# Altium schematic sheet Sheet1.SCHDOC
size B
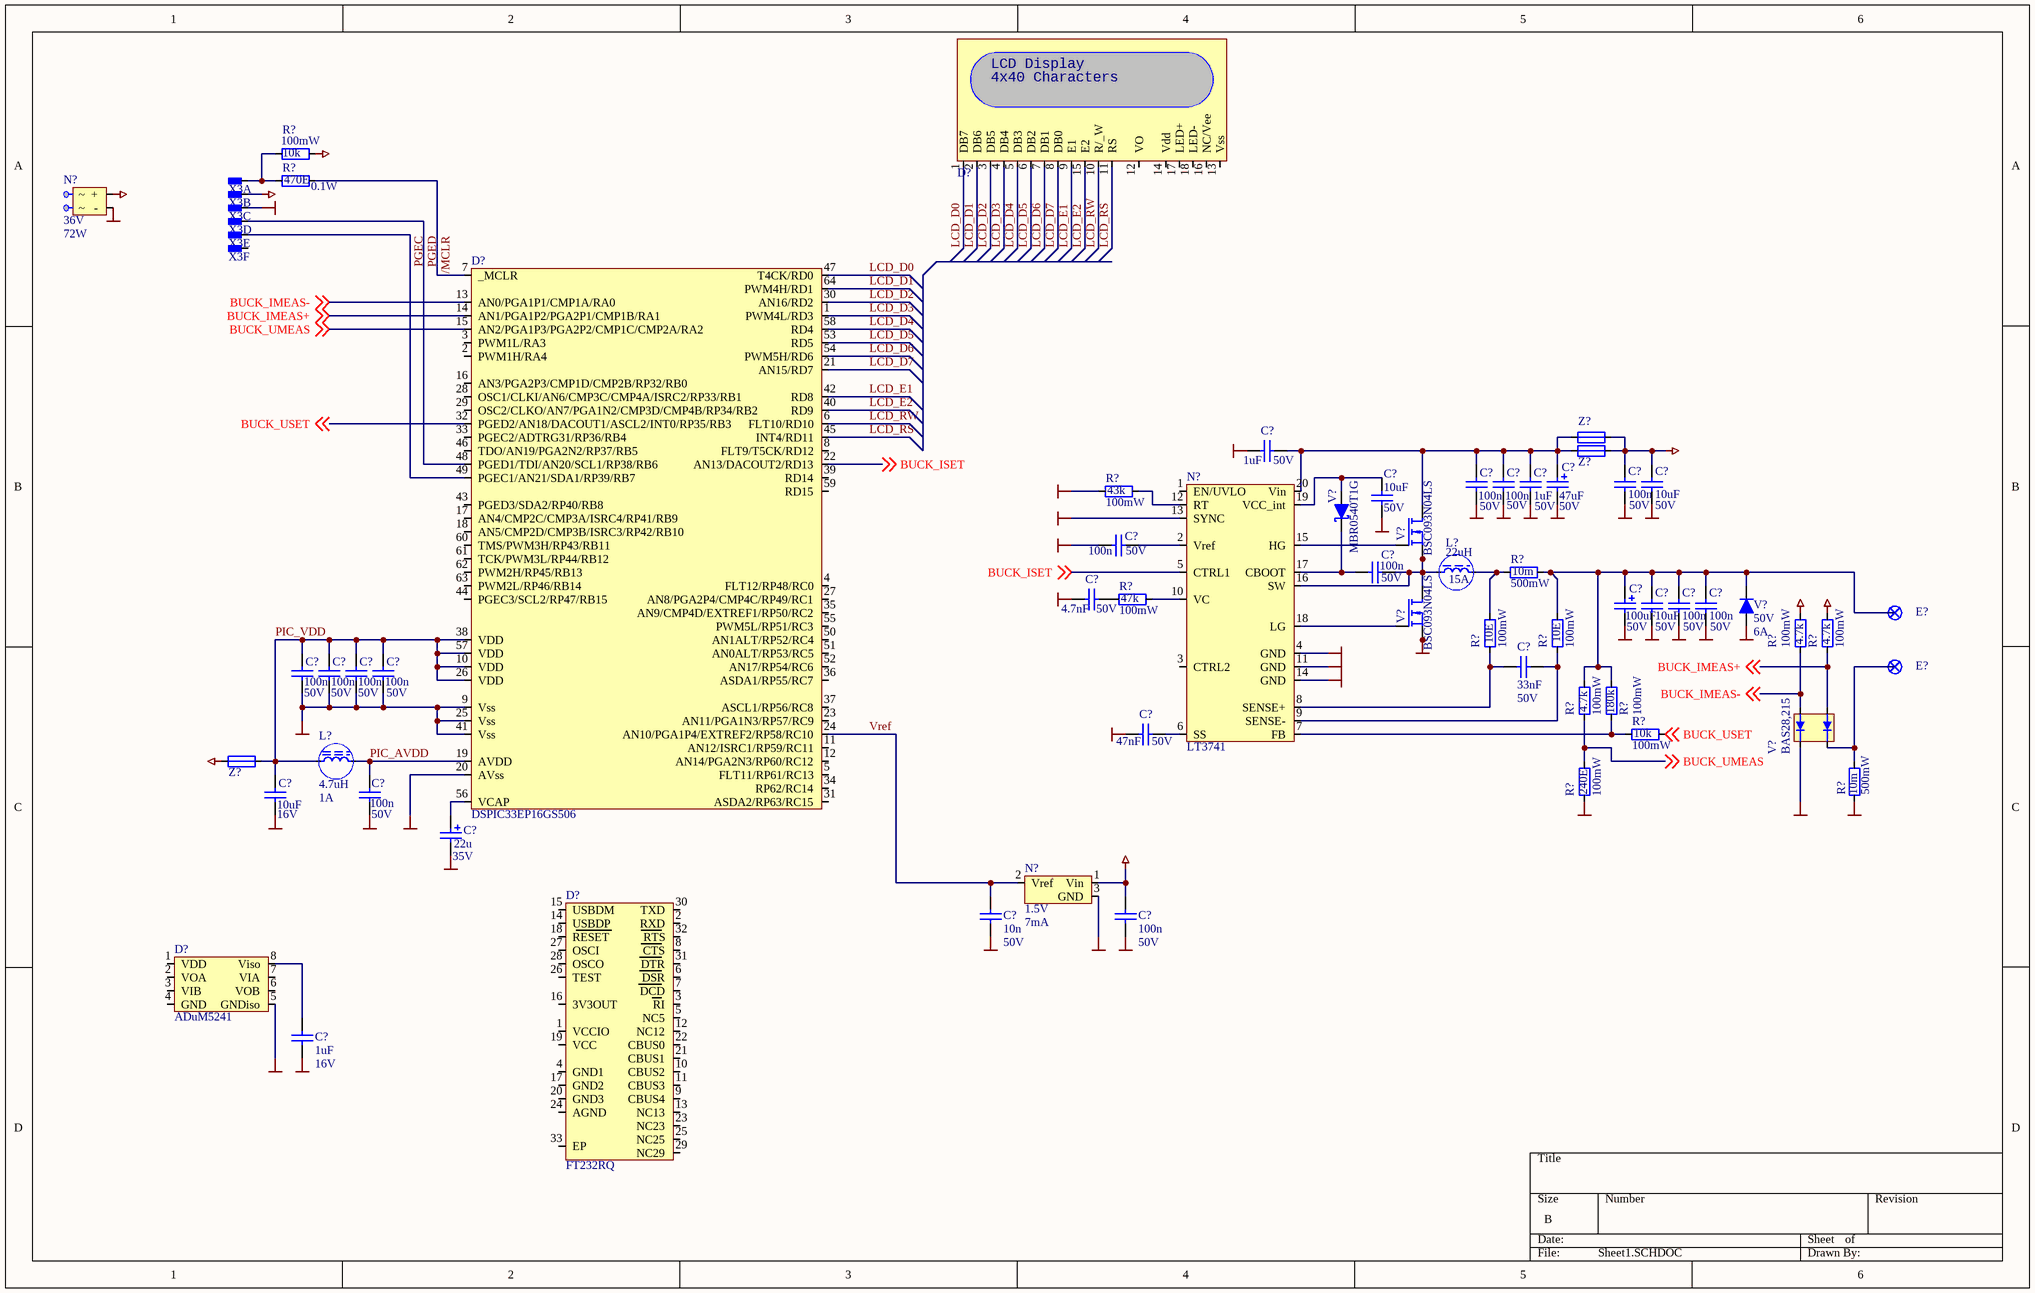
[diagram p0: Sheet1.SCHDOC]

## Parts
(Parts that share a designator on the sheet are numbered #1, #2 ... from top to bottom, then left to right.)
C?#1  value 1uF  Value2: 50V  [SMD_0805]  (hidden comment: C_SMD_CER_1U_50V_10%_X7R_0805)
C?#2  value 10uF  Value2: 50V  [SMD_1210]  (hidden comment: C_SMD_CER_10U_50V_10%_X7R_1210)
C?#3  value 100n  Value2: 50V  [SMD_0603]  (hidden comment: C_SMD_CER_100N_50V_10%_X7R_0603)
C?#4  value 100n  Value2: 50V  [SMD_0603]  (hidden comment: C_SMD_CER_100N_50V_10%_X7R_0603)
C?#5  value 1uF  Value2: 50V  [SMD_0805]  (hidden comment: C_SMD_CER_1U_50V_10%_X7R_0805)
C?#6  value 47uF  Value2: 50V  [SMD_CAP_PCV1H470MCL7GS]  (hidden comment: C_SMD_ALU_47U_50V_20%_PCV1H470MCL7GS)
C?#7  value 100n  Value2: 50V  [SMD_0603]  (hidden comment: C_SMD_CER_100N_50V_10%_X7R_0603)
C?#8  value 10uF  Value2: 50V  [SMD_1210]  (hidden comment: C_SMD_CER_10U_50V_10%_X7R_1210)
C?#9  value 100n  Value2: 50V  [SMD_0603]  (hidden comment: C_SMD_CER_100N_50V_10%_X7R_0603)
C?#10  value 100n  Value2: 50V  [SMD_0603]  (hidden comment: C_SMD_CER_100N_50V_10%_X7R_0603)
C?#11  value 4.7nF  Value2: 50V  [SMD_0603]  (hidden comment: C_SMD_CER_4N7_50V_10%_X7R_0603)
C?#12  value 100uF  Value2: 50V  [SMD_CAP_CV_10x12.7L]  (hidden comment: C_SMD_ALU_100U_50V_20%_PCV1H101MCL2GS)
C?#13  value 10uF  Value2: 50V  [SMD_1210]  (hidden comment: C_SMD_CER_10U_50V_10%_X7R_1210)
C?#14  value 100n  Value2: 50V  [SMD_0603]  (hidden comment: C_SMD_CER_100N_50V_10%_X7R_0603)
C?#15  value 100n  Value2: 50V  [SMD_0603]  (hidden comment: C_SMD_CER_100N_50V_10%_X7R_0603)
C?#16  value 33nF  Value2: 50V  [SMD_0603]  (hidden comment: C_SMD_CER_33N_50V_10%_X7R_0603)
C?#17  value 100n  Value2: 50V  [SMD_0603]  (hidden comment: C_SMD_CER_100N_50V_10%_X7R_0603)
C?#18  value 100n  Value2: 50V  [SMD_0603]  (hidden comment: C_SMD_CER_100N_50V_10%_X7R_0603)
C?#19  value 100n  Value2: 50V  [SMD_0603]  (hidden comment: C_SMD_CER_100N_50V_10%_X7R_0603)
C?#20  value 100n  Value2: 50V  [SMD_0603]  (hidden comment: C_SMD_CER_100N_50V_10%_X7R_0603)
C?#21  value 47nF  Value2: 50V  [SMD_0603]  (hidden comment: C_SMD_CER_47N_50V_10%_X7R_0603)
C?#22  value 10uF  Value2: 16V  [SMD_0805]  (hidden comment: C_SMD_CER_10U_16V_10%_X5R_0805)
C?#23  value 100n  Value2: 50V  [SMD_0603]  (hidden comment: C_SMD_CER_100N_50V_10%_X7R_0603)
C?#24  value 22u  Value2: 35V  [SMD_7343P]  (hidden comment: C_SMD_ALU_22U_35V_20&_7343P)
C?#25  value 10n  Value2: 50V  [SMD_0603]  (hidden comment: C_SMD_CER_10N_50V_10%_X7R_0603)
C?#26  value 100n  Value2: 50V  [SMD_0603]  (hidden comment: C_SMD_CER_100N_50V_10%_X7R_0603)
C?#27  value 1uF  Value2: 16V  [SMD_0603]  (hidden comment: C_SMD_CER_1U_16V_10%_X5R_0603)
D?#1  D_LCD_160CHAR_40X4_NHD-0440WH-ATMI-JT#  [THT_CON_P2.54_D0.9_2X9]  (value not drawn)
D?#2  Type: DSPIC33EP16GS506  [SMD_TQFP-64]  (hidden comment: D_DSPIC33EP16GS506_TQFP-64)
D?#3  Type: ADuM5241  [SMD_SOP_8]  (hidden comment: D_ADUM5241_SO-8)
D?#4  Type: FT232RQ  [SMD_QFN-32]  (hidden comment: D_FT232RQ)
E?#1  E_BANANA_JACK_FEMALE_RED  [THT_BANANA_JACK]  (value not drawn)
E?#2  E_BANANA_JACK_FEMALE_RED  [THT_BANANA_JACK]  (value not drawn)
L?#1  value 22uH  Value2: 15A  [SMD_INDUCT-74435582200]  (hidden comment: L_SMD_22U_15A_7MOHM_20%_74435582200)
L?#2  value 4.7uH  Value2: 1A  [SMD_0806]  (hidden comment: L_SMD_4U7_1A_20%_0806)
N?#1  value 36V  Value2: 72W  [THT_CON_P2.54_D0.9_1X2]  (hidden comment: N_EXT_ACDC_36V_75W)
N?#2  Type: LT3741  [SMD_QFN-20]  (hidden comment: N_LT3741EUF_QFN-20)
N?#3  value 1.5V  Value2: 7mA  [SMD_SOT_23_3]  (hidden comment: N_UREF_1V5_0A007_52UVRMS_ISL21080CIH315Z_SOT-23-3)
R?#1  value 10k  Value2: 100mW  [SMD_0603]  (hidden comment: R_SMD_THINFILM_10K_0W1_1%_50PPM_0603)
R?#2  value 470E  Value2: 0.1W  [SMD_0603]  (hidden comment: R_SMD_THINFILM_470E_0W1_1%_50PPM_0603)
R?#3  value 43k  Value2: 100mW  [SMD_0603]  (hidden comment: R_SMD_THINFILM_43K_0W1_0.1%_25PPM_0603)
R?#4  value 10m  Value2: 500mW  [SMD_1206]  (hidden comment: R_SMD_THICKFILM_0E01_0W5_0.5%_50PPM_1206)
R?#5  value 47k  Value2: 100mW  [SMD_0603]  (hidden comment: R_SMD_THINFILM_47K_0W1_1%_50PPM_0603)
R?#6  value 10E  Value2: 100mW  [SMD_0603]  (hidden comment: R_SMD_THINFILM_10E_0W1_1%_50PPM_0603)
R?#7  value 10E  Value2: 100mW  [SMD_0603]  (hidden comment: R_SMD_THINFILM_10E_0W1_1%_50PPM_0603)
R?#8  value 4.7k  Value2: 100mW  [SMD_0603]  (hidden comment: R_SMD_THINFILM_4K7_0W1_1%_50PPM_0603)
R?#9  value 4.7k  Value2: 100mW  [SMD_0603]  (hidden comment: R_SMD_THINFILM_4K7_0W1_1%_50PPM_0603)
R?#10  value 4.7k  Value2: 100mW  [SMD_0603]  (hidden comment: R_SMD_THINFILM_4K7_0W1_1%_50PPM_0603)
R?#11  value 180k  Value2: 100mW  [SMD_0603]  (hidden comment: R_SMD_THINFILM_180K_0W1_0.1%_25PPM_0603)
R?#12  value 10k  Value2: 100mW  [SMD_0603]  (hidden comment: R_SMD_THINFILM_10K_0W1_1%_50PPM_0603)
R?#13  value 240E  Value2: 100mW  [SMD_0603]  (hidden comment: R_SMD_THINFILM_240E_0W1_0.1%_25PPM_0603)
R?#14  value 10m  Value2: 500mW  [SMD_1206]  (hidden comment: R_SMD_THICKFILM_0E01_0W5_0.5%_50PPM_1206)
V?#1  Type: MBR0540T1G  [SMD_SOD_123]  (hidden comment: V_SMD_SCHOTTKY_MBR0540T1G_40V_0A5_SOD-123)
V?#2  Type: BSC093N04LS  [SMD_PG-TDSON-8]  (hidden comment: V_SMD_FET_NMOS_BSC093N04LS_40V_13A_24NC_0E0093_PG-TDSON-8)
V?#3  value 50V  Value2: 6A  [THT_6A05-T]  (hidden comment: V_THT_DIODE_6A05-T_50V_6A)
V?#4  Type: BSC093N04LS  [SMD_PG-TDSON-8]  (hidden comment: V_SMD_FET_NMOS_BSC093N04LS_40V_13A_24NC_0E0093_PG-TDSON-8)
V?#5  Type: BAS28,215  [SMD_SOT_143]  (hidden comment: V_SMD_DIODE_ARRAY_75V_0A215_SOT-143)
X3  X_CONNECTOR_P2.54_D0.9_1X6  [THT_CON_P2.54_D0.9_1X6]  (value not drawn)  (parts A,B,C,D,E,F of 6)
Z?#1  Z_SMD_FERRITE_5A_60E@100MHZ_0805  [SMD_0805]  (value not drawn)
Z?#2  Z_SMD_FERRITE_5A_60E@100MHZ_0805  [SMD_0805]  (value not drawn)
Z?#3  Z_SMD_FERRITE_1A5_470E@100MHZ_0603  [SMD_0603]  (value not drawn)

## Nets
+3.3V: C?#26.2 N?#3.1(Vin) R?#1.2 R?#8.2 R?#9.2 X3.2 Z?#3.2
+36V: C?#7.2 C?#8.2 N?#1.1(~__+) Z?#1.2 Z?#2.2
GND: C?#1.2 C?#2.2 C?#3.1 C?#4.1 C?#5.1 C?#6.1 C?#7.1 C?#8.1 C?#9.2 C?#11.1 C?#12.1 C?#13.1 C?#14.1 C?#15.1 C?#17.1 C?#18.1 C?#19.1 C?#20.1 C?#21.1 C?#22.1 C?#23.1 C?#24.1 C?#25.1 C?#26.1 C?#27.1 D?#2.9(Vss) D?#2.20(AVss) D?#2.25(Vss) D?#2.41(Vss) D?#3.5(GNDiso) N?#1.2(~___-) N?#2.4(GND) N?#2.11(GND) N?#2.13(SYNC) N?#2.14(GND) N?#3.3(GND) R?#3.1 R?#13.1 R?#14.1 V?#3.1 V?#4.1(Source1) V?#4.2(Source2) V?#4.3(Source3) V?#5.1(Cathode) X3.3
/MCLR: D?#2.7(_MCLR) R?#2.2
BUCK_IMEAS+: D?#2.14(AN1/PGA1P2/PGA2P1/CMP1B/RA1) R?#9.1 V?#5.3(Anode) ; off-sheet BUCK_IMEAS+
BUCK_IMEAS-: D?#2.13(AN0/PGA1P1/CMP1A/RA0) R?#8.1 V?#5.4(Anode) ; off-sheet BUCK_IMEAS-
BUCK_ISET: D?#2.22(AN13/DACOUT2/RD13) N?#2.5(CTRL1) ; off-sheet BUCK_ISET
BUCK_UMEAS: D?#2.15(AN2/PGA1P3/PGA2P2/CMP1C/CMP2A/RA2) R?#10.1 R?#13.2 ; off-sheet BUCK_UMEAS
BUCK_USET: D?#2.32(PGED2/AN18/DACOUT1/ASCL2/INT0/RP35/RB3) R?#12.1 ; off-sheet BUCK_USET
LCD_D0: D?#1.1(DB7) D?#2.47(T4CK/RD0)
LCD_D1: D?#1.2(DB6) D?#2.64(PWM4H/RD1)
LCD_D2: D?#1.3(DB5) D?#2.30(AN16/RD2)
LCD_D3: D?#1.4(DB4) D?#2.1(PWM4L/RD3)
LCD_D4: D?#1.5(DB3) D?#2.58(RD4)
LCD_D5: D?#1.6(DB2) D?#2.53(RD5)
LCD_D6: D?#1.7(DB1) D?#2.54(PWM5H/RD6)
LCD_D7: D?#1.8(DB0) D?#2.21(AN15/RD7)
LCD_E1: D?#1.9(E1) D?#2.42(RD8)
LCD_E2: D?#1.15(E2) D?#2.40(RD9)
LCD_RS: D?#1.11(RS) D?#2.45(INT4/RD11)
LCD_RW: D?#1.10(R/_W) D?#2.6(FLT10/RD10)
PGEC: D?#2.49(PGEC1/AN21/SDA1/RP39/RB7) X3.5
PGED: D?#2.48(PGED1/TDI/AN20/SCL1/RP38/RB6) X3.4
PIC_AVDD: C?#23.2 D?#2.19(AVDD) L?#2.2
PIC_VDD: C?#17.2 C?#18.2 C?#19.2 C?#20.2 C?#22.2 D?#2.10(VDD) D?#2.26(VDD) D?#2.38(VDD) D?#2.57(VDD) L?#2.1 Z?#3.1
Vref: C?#25.2 D?#2.24(AN10/PGA1P4/EXTREF2/RP58/RC10) N?#3.2(Vref)
NetC?#1_1: C?#1.1 C?#3.2 C?#4.2 C?#5.2 C?#6.2 N?#2.20(Vin) V?#2.5(Drain) Z?#1.1 Z?#2.1
NetC?#2_1: C?#2.1 N?#2.19(VCC_int) V?#1.1
NetC?#9_1: C?#9.1 N?#2.2(Vref)
NetC?#10_1: C?#10.1 N?#2.17(CBOOT) V?#1.2
NetC?#10_2: C?#10.2 L?#1.1 N?#2.16(SW) V?#2.1(Source1) V?#2.2(Source2) V?#2.3(Source3) V?#4.5(Drain)
NetC?#11_2: C?#11.2 R?#5.1
NetC?#12_2: C?#12.2 C?#13.2 C?#14.2 C?#15.2 R?#4.2 R?#7.2 R?#10.2 R?#11.2 V?#3.2
NetC?#16_1: C?#16.1 N?#2.9(SENSE-) R?#7.1
NetC?#16_2: C?#16.2 N?#2.8(SENSE+) R?#6.1
NetC?#21_2: C?#21.2 N?#2.6(SS)
NetC?#24_2: C?#24.2 D?#2.56(VCAP)
NetC?#27_2: C?#27.2 D?#3.8(Viso)
NetL?#1_2: L?#1.2 R?#4.1 R?#6.2
NetN?#2_7: N?#2.7(FB) R?#11.1 R?#12.2
NetN?#2_10: N?#2.10(VC) R?#5.2
NetN?#2_12: N?#2.12(RT) R?#3.2
NetN?#2_15: N?#2.15(HG) V?#2.4(Gate)
NetN?#2_18: N?#2.18(LG) V?#4.4(Gate)
NetR?#1_1: R?#1.1 R?#2.1 X3.1
NetR?#14_2: R?#14.2 V?#5.2(Cathode)

Not connected (* = marked no-connect by the designer): D?#1 12(VO) 13(Vss) 14(Vdd) 16(NC/Vee) 17(LED+) 18(LED-); D?#2 2(PWM1H/RA4) 3(PWM1L/RA3) 4(FLT12/RP48/RC0) 5(FLT11/RP61/RC13) 8(FLT9/T5CK/RD12) 11(AN12/ISRC1/RP59/RC11) 12(AN14/PGA2N3/RP60/RC12) 16(AN3/PGA2P3/CMP1D/CMP2B/RP32/RB0) 17(AN4/CMP2C/CMP3A/ISRC4/RP41/RB9) 18(AN5/CMP2D/CMP3B/ISRC3/RP42/RB10) 23(AN11/PGA1N3/RP57/RC9) 27(AN8/PGA2P4/CMP4C/RP49/RC1) 28(OSC1/CLKI/AN6/CMP3C/CMP4A/ISRC2/RP33/RB1) 29(OSC2/CLKO/AN7/PGA1N2/CMP3D/CMP4B/RP34/RB2) 31(ASDA2/RP63/RC15) 33(PGEC2/ADTRG31/RP36/RB4) 34(RP62/RC14) 35(AN9/CMP4D/EXTREF1/RP50/RC2) 36(ASDA1/RP55/RC7) 37(ASCL1/RP56/RC8) 39(RD14) 43(PGED3/SDA2/RP40/RB8) 44(PGEC3/SCL2/RP47/RB15) 46(TDO/AN19/PGA2N2/RP37/RB5) 50(AN1ALT/RP52/RC4) 51(AN0ALT/RP53/RC5) 52(AN17/RP54/RC6) 55(PWM5L/RP51/RC3) 59(RD15) 60(TMS/PWM3H/RP43/RB11) 61(TCK/PWM3L/RP44/RB12) 62(PWM2H/RP45/RB13) 63(PWM2L/RP46/RB14); D?#3 1(VDD) 2(VOA) 3(VIB) 4(GND) 6(VOB) 7(VIA); D?#4 1(VCCIO) 2(RXD) 3(RI) 4(GND1) 5(NC5) 6(DSR) 7(DCD) 8(CTS) 9(CBUS4) 10(CBUS2) 11(CBUS3) 12(NC12) 13(NC13) 14(USBDP) 15(USBDM) 16(3V3OUT) 17(GND2) 18(RESET) 19(VCC) 20(GND3) 21(CBUS1) 22(CBUS0) 23(NC23) 24(AGND) 25(NC25) 26(TEST) 27(OSCI) 28(OSCO) 29(NC29) 30(TXD) 31(DTR) 32(RTS) 33(EP); N?#2 1(EN/UVLO) 3(CTRL2); X3 6

## Notes on the sheet
- (in symbol D_LCD_160CHAR_40X4_NHD-0440WH-ATMI-JT#) LCD Display; 4x40 Characters

## Library data of the parts
C?#2 C?#8 C?#13 = C_SMD_CER_10U_50V_10%_X7R_1210: SMD Ceramic capacitor; Supplier - Digikey: 490-6544-1-ND
C?#3 C?#4 C?#7 C?#9 C?#10 C?#14 C?#15 C?#17-C?#20 C?#23 C?#26 = C_SMD_CER_100N_50V_10%_X7R_0603: SMD Capacitor; Supplier - E+H-flowtec SAP: 50092748
C?#11 = C_SMD_CER_4N7_50V_10%_X7R_0603: SMD Capacitor ceramic; Supplier - E+H-flowtec SAP: 50092742
C?#21 = C_SMD_CER_47N_50V_10%_X7R_0603: SMD capacitor; Supplier - E+H-flowtec SAP: 50092746
C?#22 = C_SMD_CER_10U_16V_10%_X5R_0805: SMD Capacitor; Supplier - E+H-flowtec SAP: 71107344
C?#24 = C_SMD_ALU_22U_35V_20&_7343P: SMD Aluminium capacitor; Supplier - E+H-flowtec SAP: 50093821
C?#25 = C_SMD_CER_10N_50V_10%_X7R_0603: SMD Capacitor; Supplier - E+H-flowtec SAP: 50092743
C?#27 = C_SMD_CER_1U_16V_10%_X5R_0603: SMD Capacitor; Supplier - E+H-flowtec SAP: 50106956
D?#3 = D_ADUM5241_SO-8: Digital isolator with 5V, 50mW isolated supply voltage; Supplier - Digikey: ADUM5241ARZ-RL7CT-ND
D?#4 = D_FT232RQ: FT232r USB UART IC; Supplier - Digikey: 768-1008-1-ND
E?#1 E?#2 = E_BANANA_JACK_FEMALE_RED: CONN JACK BANANA INSUL NYLON RED; Supplier - Digikey: J151-ND
L?#1 = L_SMD_22U_15A_7MOHM_20%_74435582200: Core Material: Manganese Zinc; Supplier - Digikey: 732-4237-1-ND
L?#2 = L_SMD_4U7_1A_20%_0806: SMD Inductor; Supplier - Digikey: 732-2956-1-ND
N?#2 = N_LT3741EUF_QFN-20: High Power, Constant / Current, Constant Voltage, / Step-Down Controller; Supplier - Digikey: LT3741EUF#PBF-ND
R?#1 R?#12 = R_SMD_THINFILM_10K_0W1_1%_50PPM_0603: SMD Resistor; Supplier - E+H-flowtec SAP: 50092700
R?#2 = R_SMD_THINFILM_470E_0W1_1%_50PPM_0603: SMD Resistor; Supplier - E+H-flowtec SAP: 50092681
R?#3 = R_SMD_THINFILM_43K_0W1_0.1%_25PPM_0603: SMD Resistor; Supplier - Digikey: P43KDBCT-ND
R?#4 R?#14 = R_SMD_THICKFILM_0E01_0W5_0.5%_50PPM_1206: SMD Current sense resistor; Supplier - Digikey: LVK12R010DERCT-ND
R?#5 = R_SMD_THINFILM_47K_0W1_1%_50PPM_0603: SMD Resistor; Supplier - E+H-flowtec SAP: 50092708
R?#6 R?#7 = R_SMD_THINFILM_10E_0W1_1%_50PPM_0603: SMD Resistor; Supplier - E+H-flowtec SAP: 50092664
R?#8-R?#10 = R_SMD_THINFILM_4K7_0W1_1%_50PPM_0603: SMD Resistor; Supplier - E+H-flowtec SAP: 50092694
R?#11 = R_SMD_THINFILM_180K_0W1_0.1%_25PPM_0603: SMD Resistor; Supplier - Digikey: P180KDBCT-ND
R?#13 = R_SMD_THINFILM_240E_0W1_0.1%_25PPM_0603: SMD Resistor; Supplier - Digikey: P240DBCT-ND
V?#1 = V_SMD_SCHOTTKY_MBR0540T1G_40V_0A5_SOD-123: Schottky diode, 40V, 500mA, SOD-123; Supplier - Digikey: MBR0540T1GOSCT-ND
V?#2 V?#4 = V_SMD_FET_NMOS_BSC093N04LS_40V_13A_24NC_0E0093_PG-TDSON-8: Fast switching mosfet for SMPS; Supplier - Digikey: BSC093N04LS GCT-ND
V?#3 = V_THT_DIODE_6A05-T_50V_6A: 6A05-T; Supplier - Digikey: 6A05DICT-ND
X3 = X_CONNECTOR_P2.54_D0.9_1X6: Pitch 2.54, Diameter 0.9mm, 1 row, 6 columns; Type: Pitch 2.54, Diameter 0.9mm, 1 row, 3 columns
Z?#1 Z?#2 = Z_SMD_FERRITE_5A_60E@100MHZ_0805: BEAD FERRITE 60 OHM 5A; Supplier - Digikey: MH2029-600YCT-ND; Type: MH2029-600Y; Value: 5A
Z?#3 = Z_SMD_FERRITE_1A5_470E@100MHZ_0603: FERRITE CHIP 470 OHM 1500MA 0603; Value: 1.5A; Supplier - Digikey: 490-5257-1-ND; Type: BLM18KG471SN1D
C?#1 C?#5 = C_SMD_CER_1U_50V_10%_X7R_0805: Supplier - Digikey: 587-2910-1-ND
C?#6 = C_SMD_ALU_47U_50V_20%_PCV1H470MCL7GS: Supplier - Digikey: 493-4554-1-ND
C?#12 = C_SMD_ALU_100U_50V_20%_PCV1H101MCL2GS: Supplier - Digikey: 493-4558-1-ND
C?#16 = C_SMD_CER_33N_50V_10%_X7R_0603: Supplier - Digikey: 1276-2042-1-ND
D?#1 = D_LCD_160CHAR_40X4_NHD-0440WH-ATMI-JT#: Supplier - Digikey: NHD-0440WH-ATMI-JT#-ND
D?#2 = D_DSPIC33EP16GS506_TQFP-64: Supplier - Digikey: DSPIC33EP16GS506-I/PT-ND
N?#1 = N_EXT_ACDC_36V_75W: Supplier - Digikey: 285-1829-ND
N?#3 = N_UREF_1V5_0A007_52UVRMS_ISL21080CIH315Z_SOT-23-3: Supplier - Digikey: ISL21080CIH315Z-TKCT-ND; Type: ISL21080CIH315Z-TK
V?#5 = V_SMD_DIODE_ARRAY_75V_0A215_SOT-143: Supplier - Digikey: 568-1600-1-ND